# EAGLE design Monitor3 (EAGLE 7.7.0)
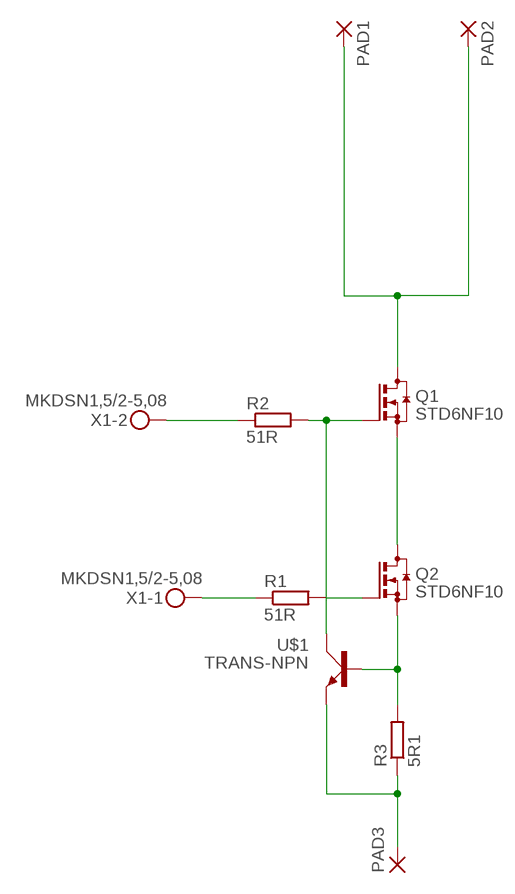
[diagram p0: schematic, sheet 1]

## Parts
PAD1  3,81/1,4  [3,81/1,4]
PAD2  3,81/1,4  [3,81/1,4]
PAD3  3,81/1,4  [3,81/1,4]
Q1  STD6NF10  [DPAK]
Q2  STD6NF10  [DPAK]
R1  51R  R_0805  [R0805]
R2  51R  R_0805  [R0805]
R3  5R1  R_0805  [R0805]
U$1  TRANS-NPN  [SOT-92WIDE]
X1  MKDSN1,5/2-5,08  [MKDSN1,5/2-5,08]

## Nets
N$1: Q1.S Q2.D
N$2: Q2.G R1.2
N$3: Q1.G R2.2 U$1.C
N$4: PAD1.1(P) PAD2.1(P) Q1.D
N$6: R2.1 X1.2
N$7: R1.1 X1.1
N$9: Q2.S R3.2 U$1.B
N$10: PAD3.1(P) R3.1 U$1.E

## Library data of the parts
PAD1-PAD3 = wirepad:3,81/1,4: THROUGH-HOLE PAD
Q1 Q2 = Namenlos:STD6NF10
R1-R3 = Namenlos:R_
U$1 = Namenlos:TRANS-NPN
X1 = con-phoenix-508:MKDSN1,5/2-5,08: MKDSN 1,5/ 2-5,08 Printklemme Nennstrom: 13,5 A Nennspannung: 250 V Rastermaß: 5,08 mm Polzahl: 2 Anschlussart: Schraubanschluss Montage: Löten Anschlussrichtung Leiter/Platine: 0 ° Artikelnummer: 1729128 Source: http://eshop.phoenixcontact.com .. 1729128.pdf

## Board
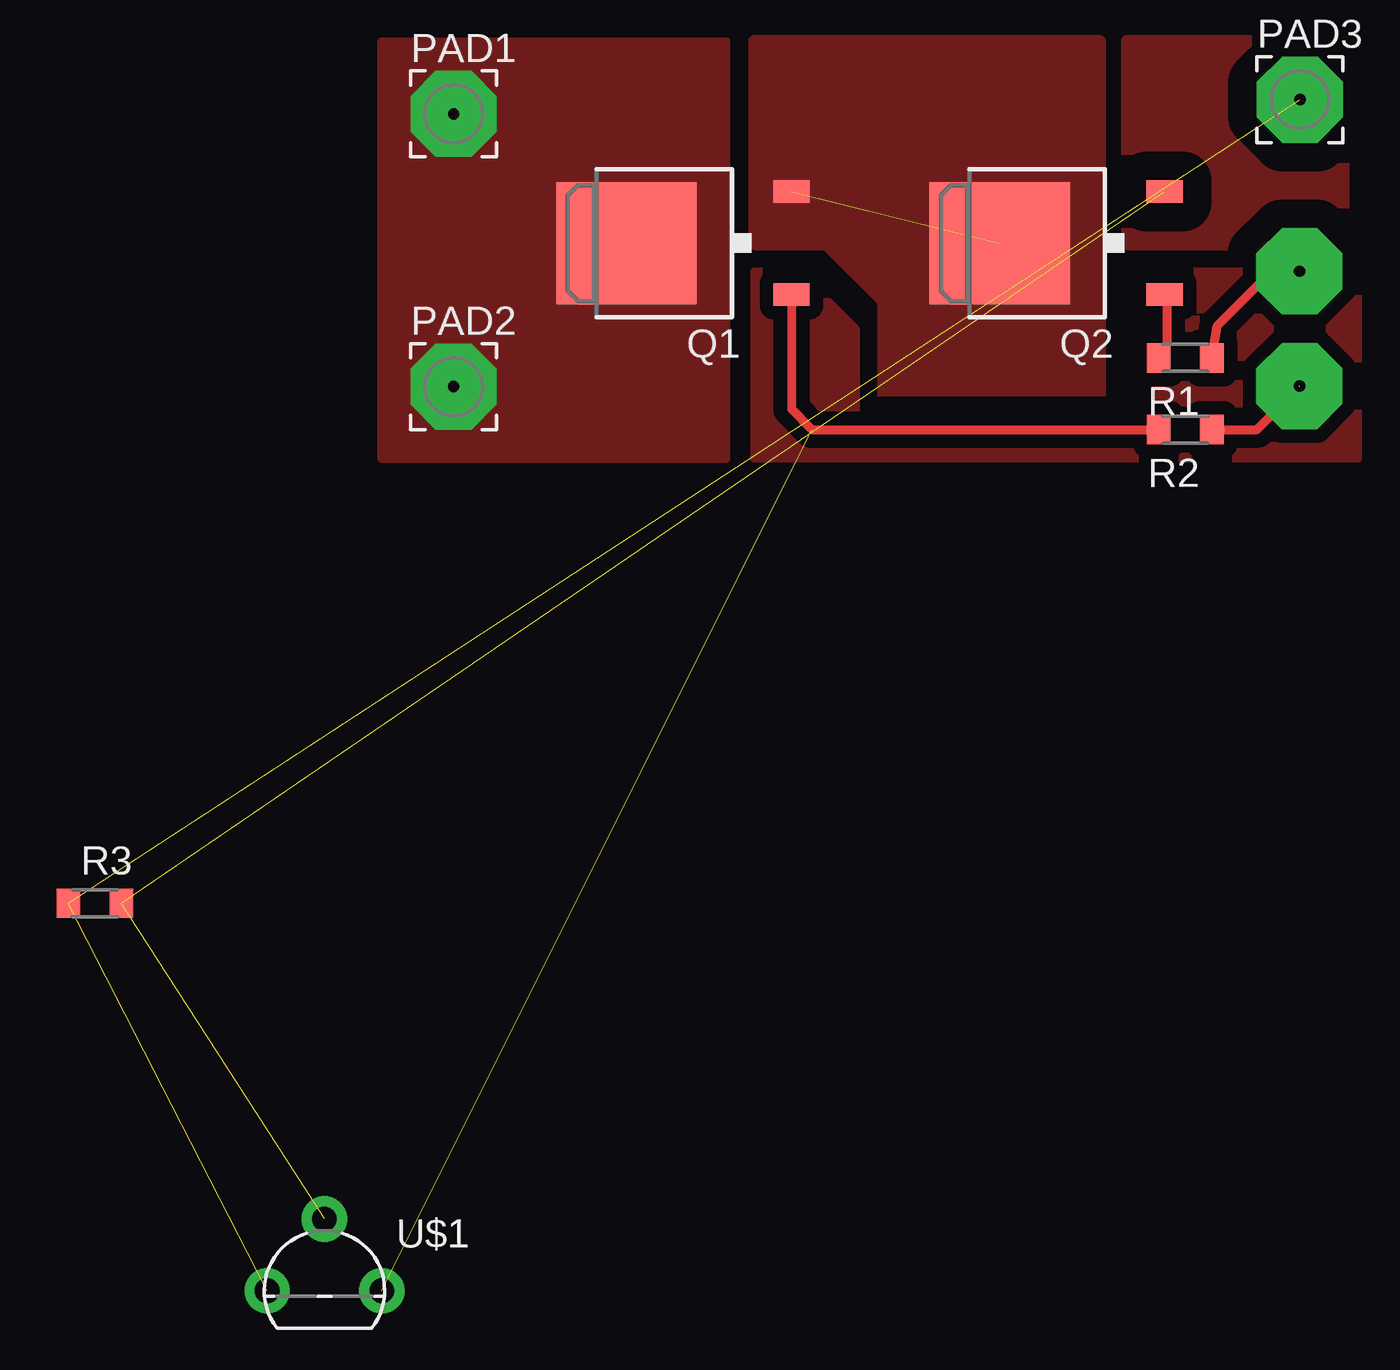
[diagram p1: board, top side]
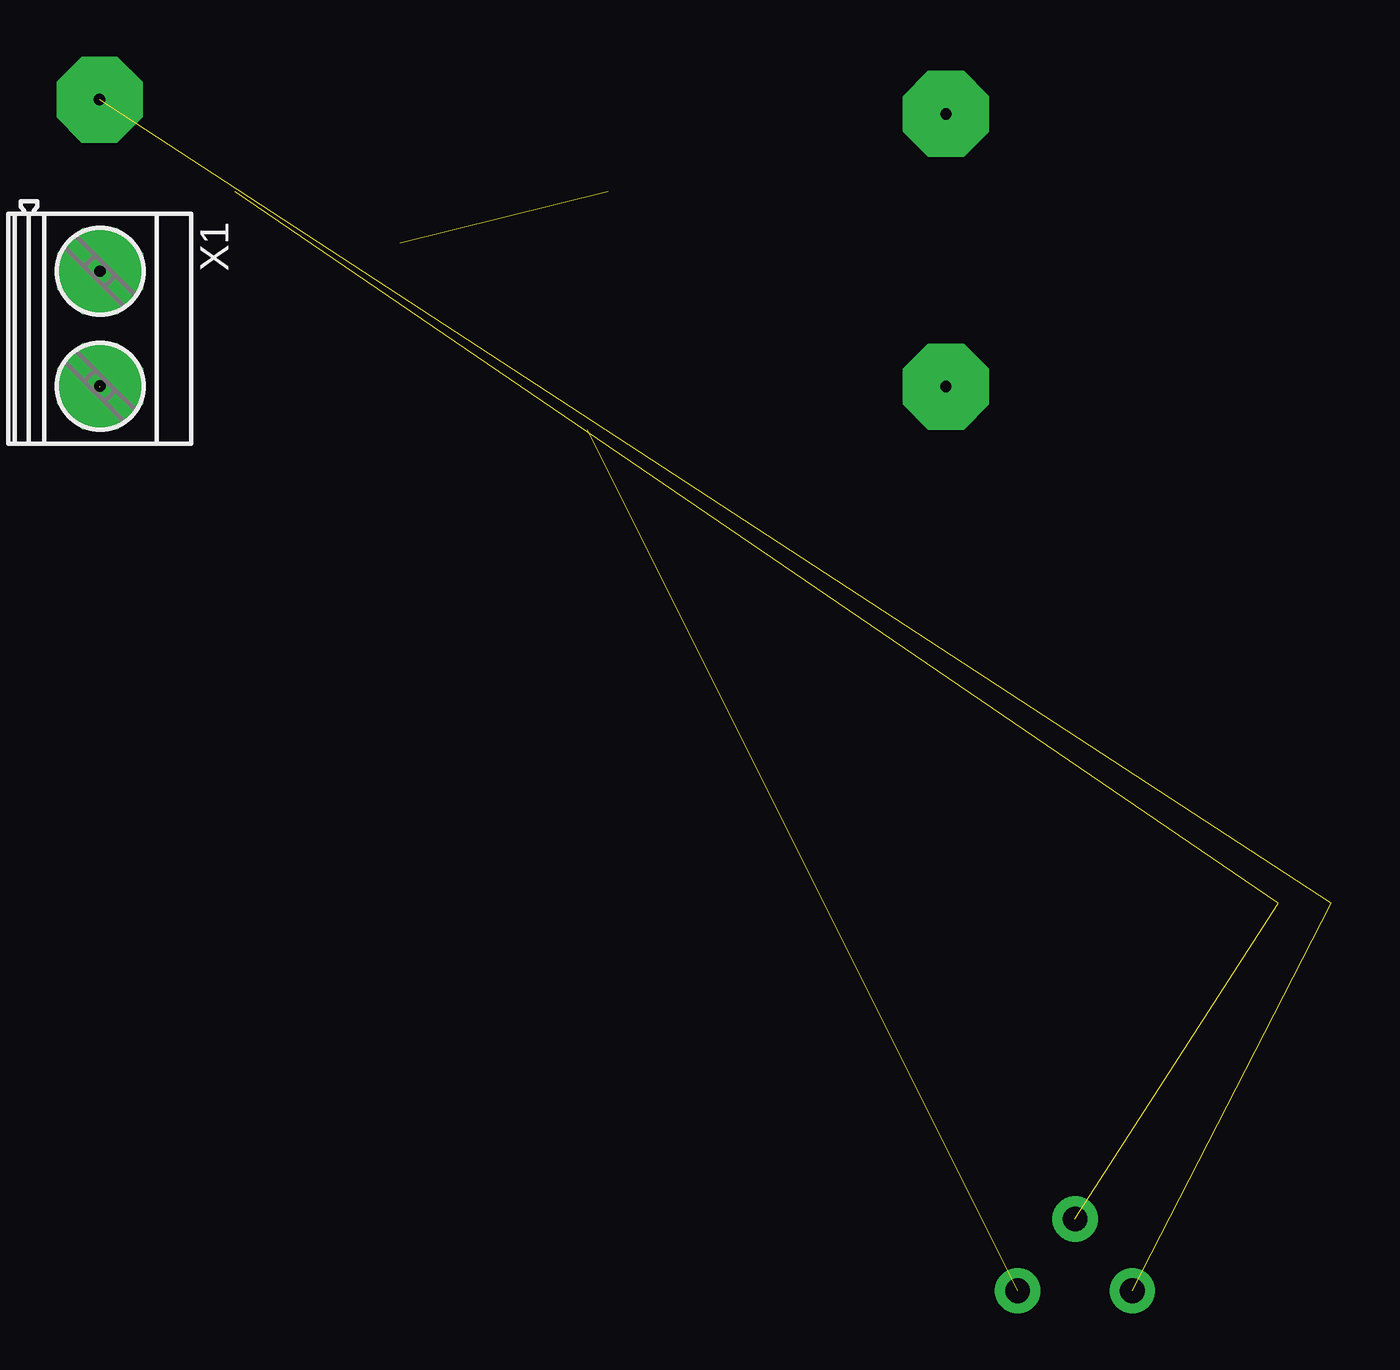
[diagram p2: board, bottom side, seen from below]

No outline drawn. Coordinates in mm, seen from the top.
Copper layers (1*16): Top 0.035mm / dielectric 1.5mm / Bottom 0.035mm
Design rules "default": minimum track width 10mil, minimum drill 24mil, track to track 8mil, track to pad 8mil, pad to pad 8mil, via to via 8mil, smd to smd 8mil, copper to edge 40mil, drill to drill 8mil, minimum pad ring 10mil, minimum via ring 8mil, stop-mask expansion 4mil, vias tented up to drill 0mil, thermal gap 10mil

### Footprints (pad centres in the part's own frame; a part is rotated, then mirrored left to right if it is on the bottom)
3,81/1,4 = drill 0.5 pad 3.81 octagon: 1 0,0
DPAK = smd 5.4 x 6.2: D 0,2.5 | smd 1 x 1.6: G -2.28,-4.8; S 2.28,-4.8
R0805 = smd 1.05 x 1.3: 1 -1.175,0; 2 1.175,0
SOT-92WIDE = drill 1.1 pad 2: B 0,2.54; C 2.54,-0.635; E -2.54,-0.635
MKDSN1,5/2-5,08 = drill 0.5 pad 3.81 octagon: 1 -2.561,0.025; 2 2.519,0.025

### Placement (x,y rotation side)
PAD1  22.23,15.88 0 top
PAD2  22.23,3.81 0 top
PAD3  59.69,16.51 0 top
Q1  32.38,10.16 90 top
Q2  48.9,10.16 90 top
R1  54.61,5.08 180 top
R2  54.61,1.91 180 top
R3  6.35,-19.05 0 top
U$1  16.51,-35.56 0 top
X1  59.69,6.35 270 bottom

### Tracks (layer width: path | path; a pad name or v marks a point on that pad's centre or on a via)
N$1  (1 unrouted)
  pour Top (isolate 1.27, no thermals): 35.56,10.16 38.73,10.16 41.27,7.62 41.27,2.54 50.8,2.54 50.8,19.05 35.56,19.05
N$2
  Top 0.406: Q2.G 53.8,7.77 53.8,5.7 R1.2
N$3  (1 unrouted)
  Top 0.406: Q1.G 37.19,2.82 38.1,1.91 R2.2
N$4
  pour Top (isolate 1.27, no thermals): 19.05,0.64 34.29,0.64 34.29,19.05 19.05,19.05
N$5
  pour Top (isolate 1.27, no thermals): 52.07,10.16 61.59,10.16 61.59,19.05 52.07,19.05
N$6  (1 unrouted)
  Top 0.406: R2.1 57.78,1.91 59.69,3.81
N$7
  Top 0.406: R1.1 56.03,6.5 58.42,8.89 59.64,8.89 X1.1
N$8
  pour Top (isolate 0.61, no thermals): 35.56,0.64 35.56,8.89 37.47,8.89 40.01,6.35 40.01,2.54 53.34,2.54 53.34,8.89 62.23,8.89 62.23,0.64
N$9  (2 unrouted)
N$10  (2 unrouted)